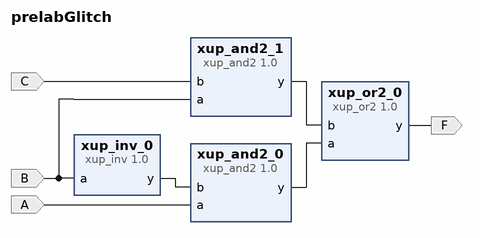
[diagram p0: block diagram of the top level]
# Vivado block design prelabGlitch, xc7a35tcpg236-1, Vivado 2019.1
create_bd_design prelabGlitch

create_bd_port -dir I A
create_bd_port -dir I C
create_bd_port -dir I B
create_bd_port -dir O F

create_bd_cell -type ip -vlnv xilinx.com:xup:xup_and2:1.0 xup_and2_0
set_property -dict {CONFIG.DELAY 1} [get_bd_cells xup_and2_0]
create_bd_cell -type ip -vlnv xilinx.com:xup:xup_inv:1.0 xup_inv_0
set_property -dict {CONFIG.DELAY 3} [get_bd_cells xup_inv_0]
create_bd_cell -type ip -vlnv xilinx.com:xup:xup_and2:1.0 xup_and2_1
set_property -dict {CONFIG.DELAY 1} [get_bd_cells xup_and2_1]
create_bd_cell -type ip -vlnv xilinx.com:xup:xup_or2:1.0 xup_or2_0

# ---- connections ----

connect_bd_net [get_bd_pins xup_inv_0/y] [get_bd_pins xup_and2_0/b]
connect_bd_net -net a_0_1 [get_bd_ports A] [get_bd_pins xup_and2_0/a]
connect_bd_net -net b_0_1 [get_bd_ports C] [get_bd_pins xup_and2_1/b]
connect_bd_net [get_bd_ports B] [get_bd_pins xup_inv_0/a] [get_bd_pins xup_and2_1/a]
connect_bd_net [get_bd_pins xup_and2_0/y] [get_bd_pins xup_or2_0/a]
connect_bd_net [get_bd_pins xup_and2_1/y] [get_bd_pins xup_or2_0/b]
connect_bd_net [get_bd_pins xup_or2_0/y] [get_bd_ports F]

validate_bd_design
save_bd_design
